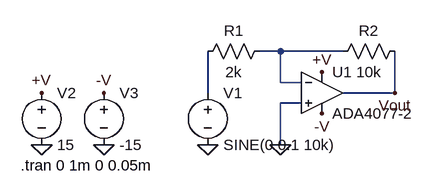
[diagram p0: schematic Draft1.asc]
Draft1.asc, the LTspice schematic file:
Version 4.1
SHEET 1 880 680
WIRE 144 96 112 96
WIRE 240 96 144 96
WIRE 144 144 144 96
WIRE 176 144 144 144
WIRE 32 160 32 96
WIRE 320 160 320 96
WIRE 320 160 240 160
WIRE 176 176 144 176
WIRE 144 240 144 176
FLAG -224 240 0
FLAG -128 240 0
FLAG -224 160 +V
FLAG 208 128 +V
FLAG -128 160 -V
FLAG 208 192 -V
FLAG 32 240 0
FLAG 144 240 0
FLAG 320 160 Vout
SYMBOL OpAmps\\ADA4077-2 208 96 R0
SYMATTR InstName U1
SYMBOL res 128 80 R90
WINDOW 0 0 56 VBottom 2
WINDOW 3 32 56 VTop 2
SYMATTR InstName R1
SYMATTR Value 2k
SYMBOL res 336 80 R90
WINDOW 0 0 56 VBottom 2
WINDOW 3 32 56 VTop 2
SYMATTR InstName R2
SYMATTR Value 10k
SYMBOL voltage 32 144 R0
WINDOW 123 0 0 Left 0
WINDOW 39 0 0 Left 0
SYMATTR InstName V1
SYMATTR Value SINE(0 0.1 10k)
SYMBOL voltage -224 144 R0
WINDOW 123 0 0 Left 0
WINDOW 39 0 0 Left 0
SYMATTR InstName V2
SYMATTR Value 15
SYMBOL voltage -128 144 R0
WINDOW 123 0 0 Left 0
WINDOW 39 0 0 Left 0
SYMATTR InstName V3
SYMATTR Value -15
TEXT -256 272 Left 2 !.tran 0 1m 0 0.05m

The netlist it stands for:
* Draft1.asc
X§U1 0 N001 +V -V Vout ADA4077-2  ; pins In+ In- V+ V- OUT
R1 N001 N002 2k
R2 Vout N001 10k
V1 N002 0 SINE(0 0.1 10k)
V2 +V 0 15
V3 -V 0 -15
.tran 0 1m 0 0.05m
.backanno
.end